# EAGLE design FourRandomLamps (EAGLE 8.3.2)
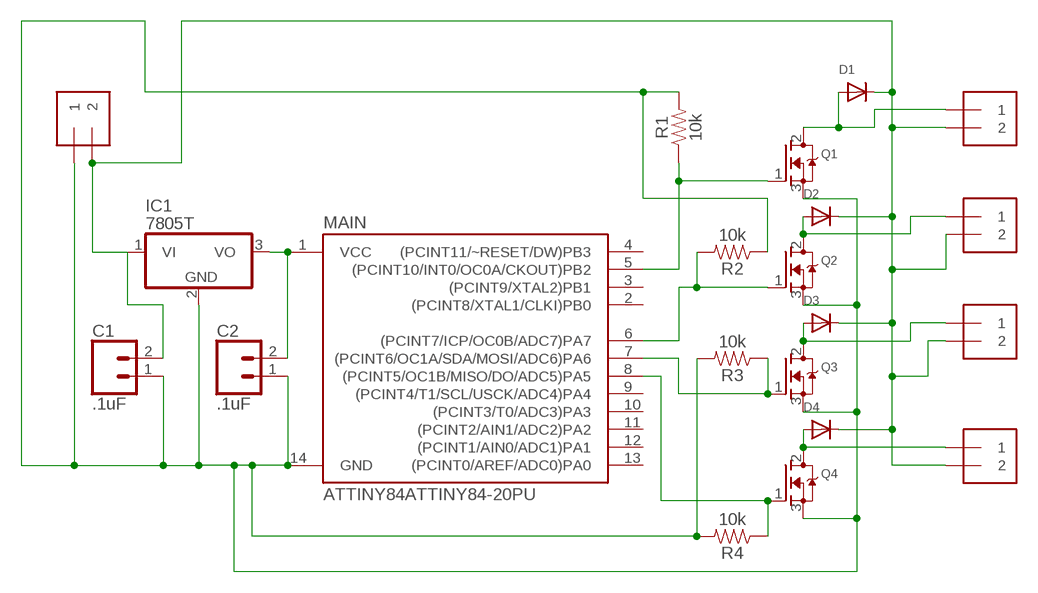
[diagram p0: schematic, sheet 1]

## Parts
12VDC  1X2-3.5MM  [1X2-3.5MM]
C1  .1uF  CONN_02LOCK  [1X02_LOCK]
C2  .1uF  CONN_02LOCK  [1X02_LOCK]
D1  DIODEDO-1N4148  [DO-1N4148]
D2  DIODEDO-1N4148  [DO-1N4148]
D3  DIODEDO-1N4148  [DO-1N4148]
D4  DIODEDO-1N4148  [DO-1N4148]
IC1  7805T  [TO220H]
LAMP1  1X2-3.5MM  [1X2-3.5MM]
LAMP2  1X2-3.5MM  [1X2-3.5MM]
LAMP3  1X2-3.5MM  [1X2-3.5MM]
LAMP4  1X2-3.5MM  [1X2-3.5MM]
MAIN  ATTINY84ATTINY84-20PU  [DIP14]
Q1  MOSFET-NGDS_TO220V  [TO220V]
Q2  MOSFET-NGDS_TO220V  [TO220V]
Q3  MOSFET-NGDS_TO220V  [TO220V]
Q4  MOSFET-NGDS_TO220V  [TO220V]
R1  10k  10KOHM-HORIZ-1/4W-5%  [AXIAL-0.3]
R2  10k  10KOHM-HORIZ-1/4W-5%  [AXIAL-0.3]
R3  10k  10KOHM-HORIZ-1/4W-5%  [AXIAL-0.3]
R4  10k  10KOHM-HORIZ-1/4W-5%  [AXIAL-0.3]

## Nets
N$1: C2.2 IC1.3(VO) MAIN.1(VCC)
N$2: 12VDC.2 C1.2 D1.C D2.C D3.C D4.C LAMP1.2 LAMP2.2 LAMP3.2 LAMP4.2
N$3: MAIN.5((PCINT10/INT0/OC0A/CKOUT)PB2) Q1.1(G) R1.P$1
N$4: MAIN.6((PCINT7/ICP/OC0B/ADC7)PA7) Q2.1(G) R2.P$2
N$5: MAIN.7((PCINT6/OC1A/SDA/MOSI/ADC6)PA6) Q3.1(G) R3.P$1
N$6: MAIN.8((PCINT5/OC1B/MISO/DO/ADC5)PA5) Q4.1(G) R4.P$1
N$7: 12VDC.1 C1.1 C2.1 IC1.2(GND) MAIN.14(GND) Q1.3(S) Q2.3(S) Q3.3(S) Q4.3(S) R1.P$2 R2.P$1 R3.P$2 R4.P$2
N$9: D1.A LAMP1.1 Q1.2(D)
N$10: D2.A LAMP2.1 Q2.2(D)
N$11: D3.A LAMP3.1 Q3.2(D)
N$13: D4.A LAMP4.1 Q4.2(D)
Unconnected: IC1.1(VI) MAIN.2((PCINT8/XTAL1/CLKI)PB0) MAIN.3((PCINT9/XTAL2)PB1) MAIN.4((PCINT11/~RESET/DW)PB3) MAIN.9((PCINT4/T1/SCL/USCK/ADC4)PA4) MAIN.10((PCINT3/T0/ADC3)PA3) MAIN.11((PCINT2/AIN1/ADC2)PA2) MAIN.12((PCINT1/AIN0/ADC1)PA1) MAIN.13((PCINT0/AREF/ADC0)PA0)

## Library data of the parts
12VDC LAMP1-LAMP4 = adafruit:1X2: 3.5mm Terminal block http://www.ladyada.net/library/pcb/eaglelibrary.html
C1 C2 = SparkFun-Connectors:CONN_02: Multi connection point. Often used as Generic Header-pin footprint for 0.1 inch spaced/style header connections On any of the 0.1 inch spaced packages, you can populate with these: Break Away Headers - Straight <https://www.sparkfun.com/products/116> (PRT-00116) Break Away Male Headers - Right Angle <https://www.sparkfun.com/products/553> (PRT-00553) Female Headers <https://www.sparkfun.com/products/115> (PRT-00115) Break Away Headers - Machine Pin <https://www.sparkfun.com/products/117> (PRT-00117) Break Away Female Headers - Swiss Machine Pin <https://www.sparkfun.com/products/743> (PRT-00743) For SCREWTERMINALS and SPRING TERMINALS visit here: Screw Terimnals on SparkFun.com <https://www.sparkfun.com/search/results?term=Screw+Terminals> (5mm/3.5mm/2.54mm spacing) This device is also useful as a general connection point to wire up your design to another part of your project. Our various solder wires solder well into these plated through hole pads. Hook-Up Wire - Assortment (Stranded, 22 AWG) <https://www.sparkfun.com/products/11375> (PRT-11375) Hook-Up Wire - Assortment (Solid Core, 22 AWG) <https://www.sparkfun.com/products/11367> (PRT-11367) View the entire wire category on our website here <https://www.sparkfun.com/categories/141> Special notes: Molex polarized connector foot print use with: PRT-08233 with associated crimp pins and housings. 2.54_SCREWTERM for use with PRT-10571. 3.5mm Screw Terminal footprints for PRT-08084 5mm Screw Terminal footprints for use with PRT-08432
D1-D4 = adafruit:DIODE: Diode SMADIODE - SMA Surface Mount Package 20V 1A Schottky Diode Digikey: 641-1014-6-ND DO-1N4148 - Through Hole Small Current Diode SOD-123 20V 1 A (.5mV Vf) Schottky Diode - Digikey: MBRX120TPMSCT-ND SOD-323 10V 570mA (.38mV Vf, 3ns) Schottky Diode - Digikey: ZLLS410CT-ND SOD-523 30V 30mA Schottky Diode (RB751S-40TE61) - Digikey: RB751S-40TE61CT-ND SOT23-R/W - SOT23 Package (R = Solder Paste/Reflow Ovens, W = Hand-Soldering) BAT54Film 40V 300mA - Digikey: 497-7162-1-ND
IC1 = adafruit:78*: Positive VOLTAGE REGULATOR Added bigger pads to the TO-92 package
MAIN = SparkFun-IC-Microcontroller:ATTINY84: Atmel 14-pin 2/4/8kB flash uC Datasheet <https://cdn.sparkfun.com/datasheets/Widgets/doc8006.pdf> SparkFun Products Tiny AVR Programmer <https://www.sparkfun.com/products/11801> (PGM-11801) SparkFun Servo Trigger - Continuous Rotation <https://www.sparkfun.com/products/13872> (WIG-13872) SparkFun Servo Trigger <https://www.sparkfun.com/products/13118> (WIG-13118)
Q1-Q4 = adafruit:MOSFET-N: N-Channel Mosfet 2N7002E - 60V 260mA SOT23 [Digikey: 2N7002ET1GOSTR-ND] - REEL BSH103 - 30V 850mA SOT23 [Digikey: 568-5013-1-ND]
R1-R4 = SparkFun-Resistors:10KOHM: 10kΩ resistor A resistor is a passive two-terminal electrical component that implements electrical resistance as a circuit element. Resistors act to reduce current flow, and, at the same time, act to lower voltage levels within circuits. - Wikipedia; PROD_ID: RES-09435

## Board
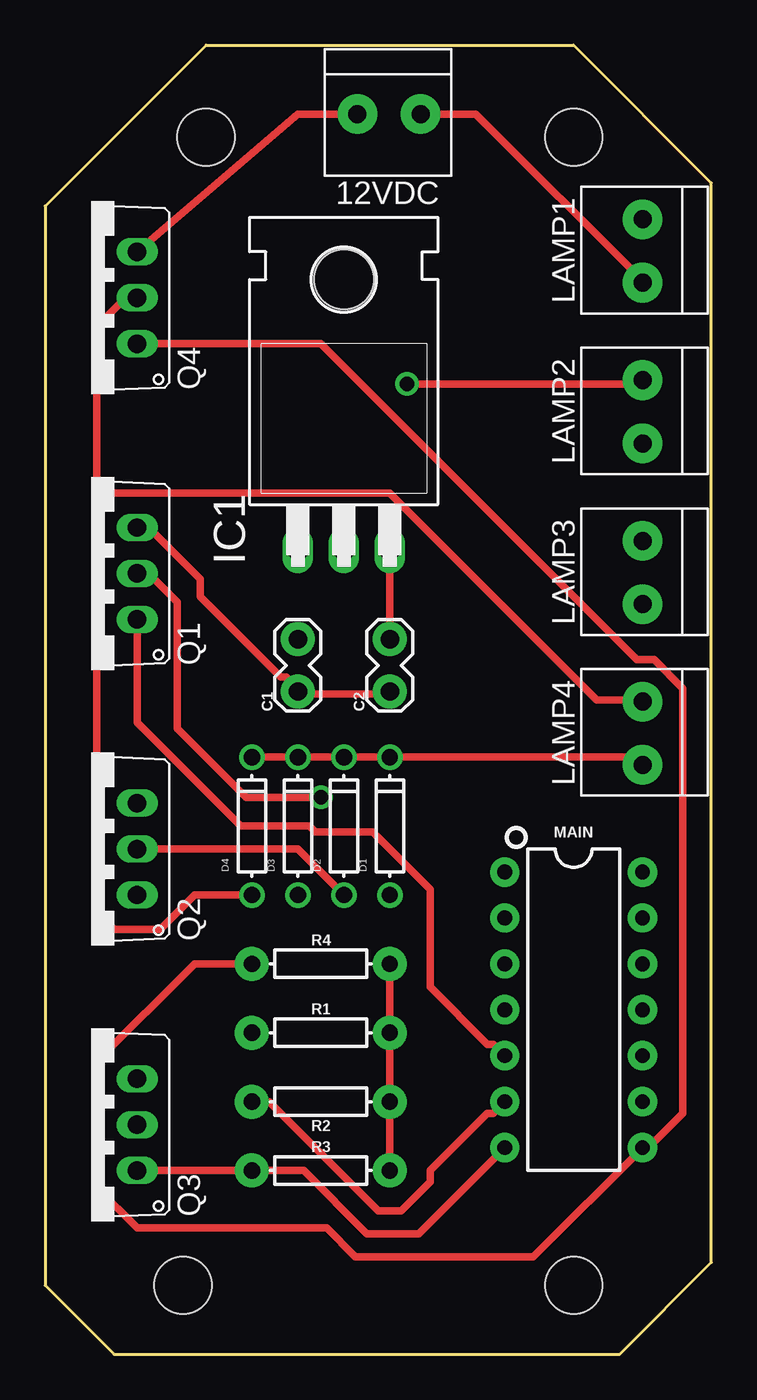
[diagram p1: board, top side]
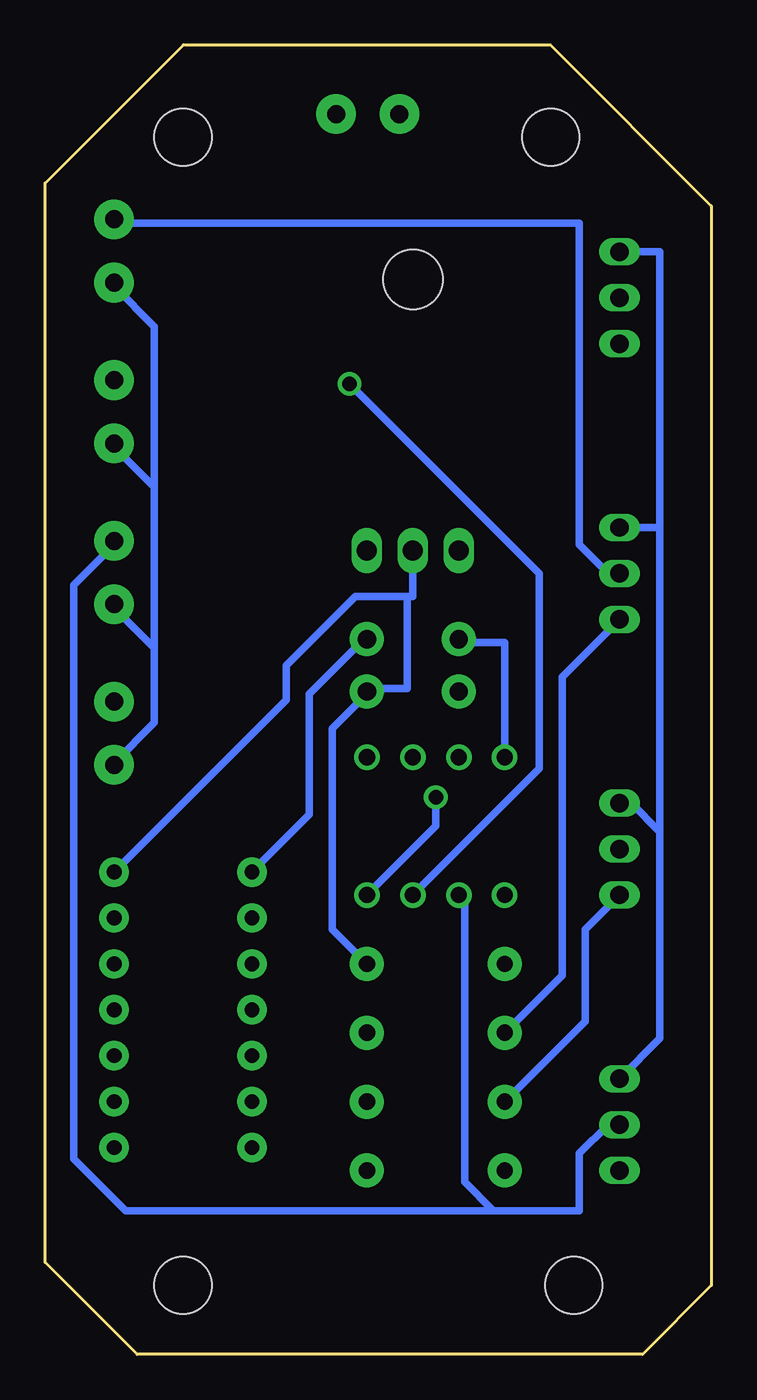
[diagram p2: board, bottom side, seen from below]

Size 36.83 x 72.39 mm. Coordinates in mm from the lower left corner, seen from the top.
Outline: 3.81,0 31.75,0 36.83,5.08 36.83,64.77 29.21,72.39 8.89,72.39 0,63.5 0,3.81 3.81,0
Copper layers (1*16): Top 0.035mm / dielectric 1.5mm / Bottom 0.035mm
Design rules "OthermillDRC_1_32_v2 *": minimum track width 16mil, minimum drill 0.8mm, track to track 0.794003125mm, track to pad 0.794003125mm, pad to pad 0.794003125mm, via to via 0.794003125mm, smd to smd 0mil, copper to edge 0mil, drill to drill 1mil, minimum pad ring 10mil, minimum via ring 10mil, stop-mask expansion 1mil, vias tented up to drill 30mil, thermal gap 10mil
Holes 3.17 mm at 8.89,67.31 7.62,3.81 29.21,3.81 29.21,67.31

### Footprints (pad centres in the part's own frame; a part is rotated, then mirrored left to right if it is on the bottom)
1X2-3.5MM = drill 1 pad 2.184: 1 1.8,0; 2 -1.7,0
1X02_LOCK = drill 1.016 pad 1.88: 1 -0.178,0; 2 2.718,0
DO-1N4148 = drill 0.9: A -3.81,0; C 3.81,0
TO220H = drill 1.118 long: 1 -2.54,-10.16; 2 0,-10.16; 3 2.54,-10.16 | hole 3.302: 0,4.826
DIP14 = drill 0.813 pad 1.626: 1 -7.62,-3.81; 2 -5.08,-3.81; 3 -2.54,-3.81; 4 0,-3.81; 5 2.54,-3.81; 6 5.08,-3.81; 7 7.62,-3.81; 8 7.62,3.81; 9 5.08,3.81; 10 2.54,3.81; 11 0,3.81; 12 -2.54,3.81; 13 -5.08,3.81; 14 -7.62,3.81
TO220V = drill 1.016 long: 1 -2.54,-2.54; 2 0,-2.54; 3 2.54,-2.54
AXIAL-0.3 = drill 0.9 pad 1.88: P$1 -3.81,0; P$2 3.81,0

### Placement (x,y rotation side)
12VDC  19.05,68.58 180 top
C1  13.97,36.83 90 top
C2  19.05,36.83 90 top
D1  19.05,29.21 90 top
D2  16.51,29.21 90 top
D3  13.97,29.21 90 top
D4  11.43,29.21 90 top
IC1  16.51,54.61 0 top
LAMP1  33.02,60.96 90 top
LAMP2  33.02,52.07 90 top
LAMP3  33.02,43.18 90 top
LAMP4  33.02,34.29 90 top
MAIN  29.21,19.05 270 top
Q1  2.54,43.18 90 top
Q2  2.54,27.94 90 top
Q3  2.54,12.7 90 top
Q4  2.54,58.42 90 top
R1  15.24,17.78 0 top
R2  15.24,13.97 180 top
R3  15.24,10.16 0 top
R4  15.24,21.59 0 top

### Tracks (layer width: path | path; a pad name or v marks a point on that pad's centre or on a via)
N$1
  Top 0.406: C2.2 IC1.3
  Bottom 0.406: MAIN.1 22.23,29.84 22.23,36.51 19.05,39.69 C2.2
N$2
  Top 0.406: 12VDC.2 23.81,68.58 33.02,59.37 LAMP1.2 | D4.C D3.C D2.C D1.C 32.7,33.02 33.02,32.7 LAMP4.2
  Bottom 0.406: D4.C 11.43,39.37 13.97,39.37 C1.2 | 30.8,39.05 30.8,34.93 33.02,32.7 LAMP4.2 | 30.8,39.05 33.02,41.28 LAMP3.2 | 30.8,47.94 33.02,50.17 LAMP2.2 | 30.8,39.05 30.8,47.94 | 30.8,47.94 30.8,56.83 33.02,59.05 LAMP1.2
N$3
  Top 0.406: MAIN.5 24.77,17.14 24.45,17.14 21.27,20.32 21.27,25.72 18.1,28.89 14.92,28.89 14.61,29.21 10.79,29.21 5.08,34.93 Q1.1
  Bottom 0.406: Q1.1 8.26,37.47 8.26,20.95 R1.P$1
N$4
  Top 0.406: MAIN.6 24.77,13.33 24.45,13.33 21.27,10.16 21.27,9.53 19.68,7.94 18.41,7.94 12.38,13.97 R2.P$2
  Bottom 0.406: Q2.1 6.99,23.5 6.99,18.41 R2.P$2
N$5
  Top 0.406: Q3.1 R3.P$1 14.29,10.16 17.78,6.67 20.64,6.67 MAIN.7
N$6
  Top 0.406: Q4.1 15.24,55.88 32.7,38.42 33.66,38.42 35.24,36.83 35.24,13.33 33.34,11.43 MAIN.8 26.99,5.4 17.14,5.4 15.56,6.98 5.08,6.98 2.86,9.21 2.86,16.19 8.26,21.59 R4.P$1
N$7
  Top 0.406: R3.P$2 R2.P$1 R1.P$2 R4.P$2 | C2.1 19.05,36.51 13.97,36.51 C1.1 13.97,36.83 13.34,37.47 13.02,37.47 8.57,41.91 8.57,42.86 5.71,45.72 Q1.3 | 12VDC.1 13.97,68.58 Q4.3
  Bottom 0.406: MAIN.14 23.5,36.2 23.5,38.1 19.68,41.91 16.83,41.91 | 16.83,41.91 16.51,41.91 IC1.2 | 16.83,41.91 16.83,36.83 19.05,36.83 C2.1 19.05,36.51 20.95,34.61 20.95,23.5 R4.P$2 | Q3.3 2.86,17.46 2.86,28.89 | 2.86,28.89 4.45,30.48 Q2.3 | 2.86,45.72 Q1.3 | 2.86,28.89 2.86,45.72 | Q4.3 2.86,60.96 2.86,45.72
N$9  (via drill 0.8)
  Top 0.406: v15.24,30.8 11.11,30.8 7.3,34.61 7.3,41.59 5.71,43.18 Q1.2
  Bottom 0.406: D1.A 15.24,29.21 v15.24,30.8 | Q1.2 5.71,43.18 7.3,44.77 7.3,62.55 33.02,62.55 LAMP1.1
N$10  (via drill 0.8)
  Top 0.406: D2.A 13.97,27.94 Q2.2 | v20,53.66 33.02,53.66 LAMP2.1
  Bottom 0.406: v20,53.66 9.53,43.18 9.53,32.38 D2.A
N$11
  Bottom 0.406: D3.A 13.65,25.08 13.65,9.53 12.06,7.94 | 12.06,7.94 7.3,7.94 7.3,11.11 5.71,12.7 Q3.2 | 12.06,7.94 32.38,7.94 35.24,10.79 35.24,42.55 33.02,44.77 LAMP3.1
N$13
  Top 0.406: D4.A 8.26,25.4 6.35,23.5 3.81,23.5 2.86,24.45 2.86,47.62 | 2.86,47.62 2.86,56.83 4.45,58.42 Q4.2 | 2.86,47.62 19.05,47.62 30.48,36.2 33.02,36.2 LAMP4.1